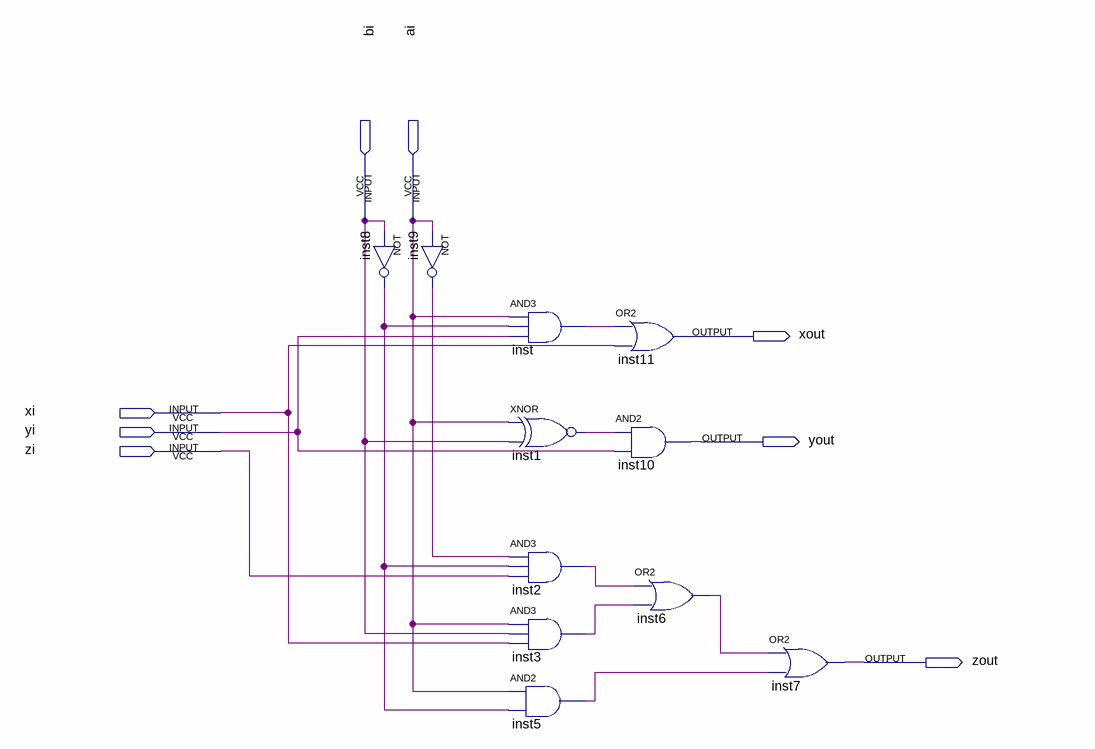
[diagram p0: schematic sheet]
// Quartus schematic CmpSignedDemo.bdf as structural Verilog: 11 symbols, 8 pins
module CmpSignedDemo (
  input  bi,
  input  ai,
  input  xi,
  input  yi,
  input  zi,
  output xout,
  output yout,
  output zout
);

  wire inst1_out, inst2_out, inst3_out, inst5_out, inst6_out, inst8_out, inst9_out, inst_out;

  not inst8 (inst8_out, bi);
  not inst9 (inst9_out, ai);
  and inst (inst_out, ai, inst8_out, yi);
  xnor inst1 (inst1_out, ai, bi);
  and inst2 (inst2_out, inst9_out, inst8_out, zi);
  and inst3 (inst3_out, ai, bi, xi);
  and inst5 (inst5_out, ai, inst8_out);
  or inst11 (xout, inst_out, xi);
  and inst10 (yout, inst1_out, yi);
  or inst6 (inst6_out, inst2_out, inst3_out);
  or inst7 (zout, inst6_out, inst5_out);
endmodule
